# EAGLE schematic GasSensorCentral_v4.0 (EAGLE 7.4.0)
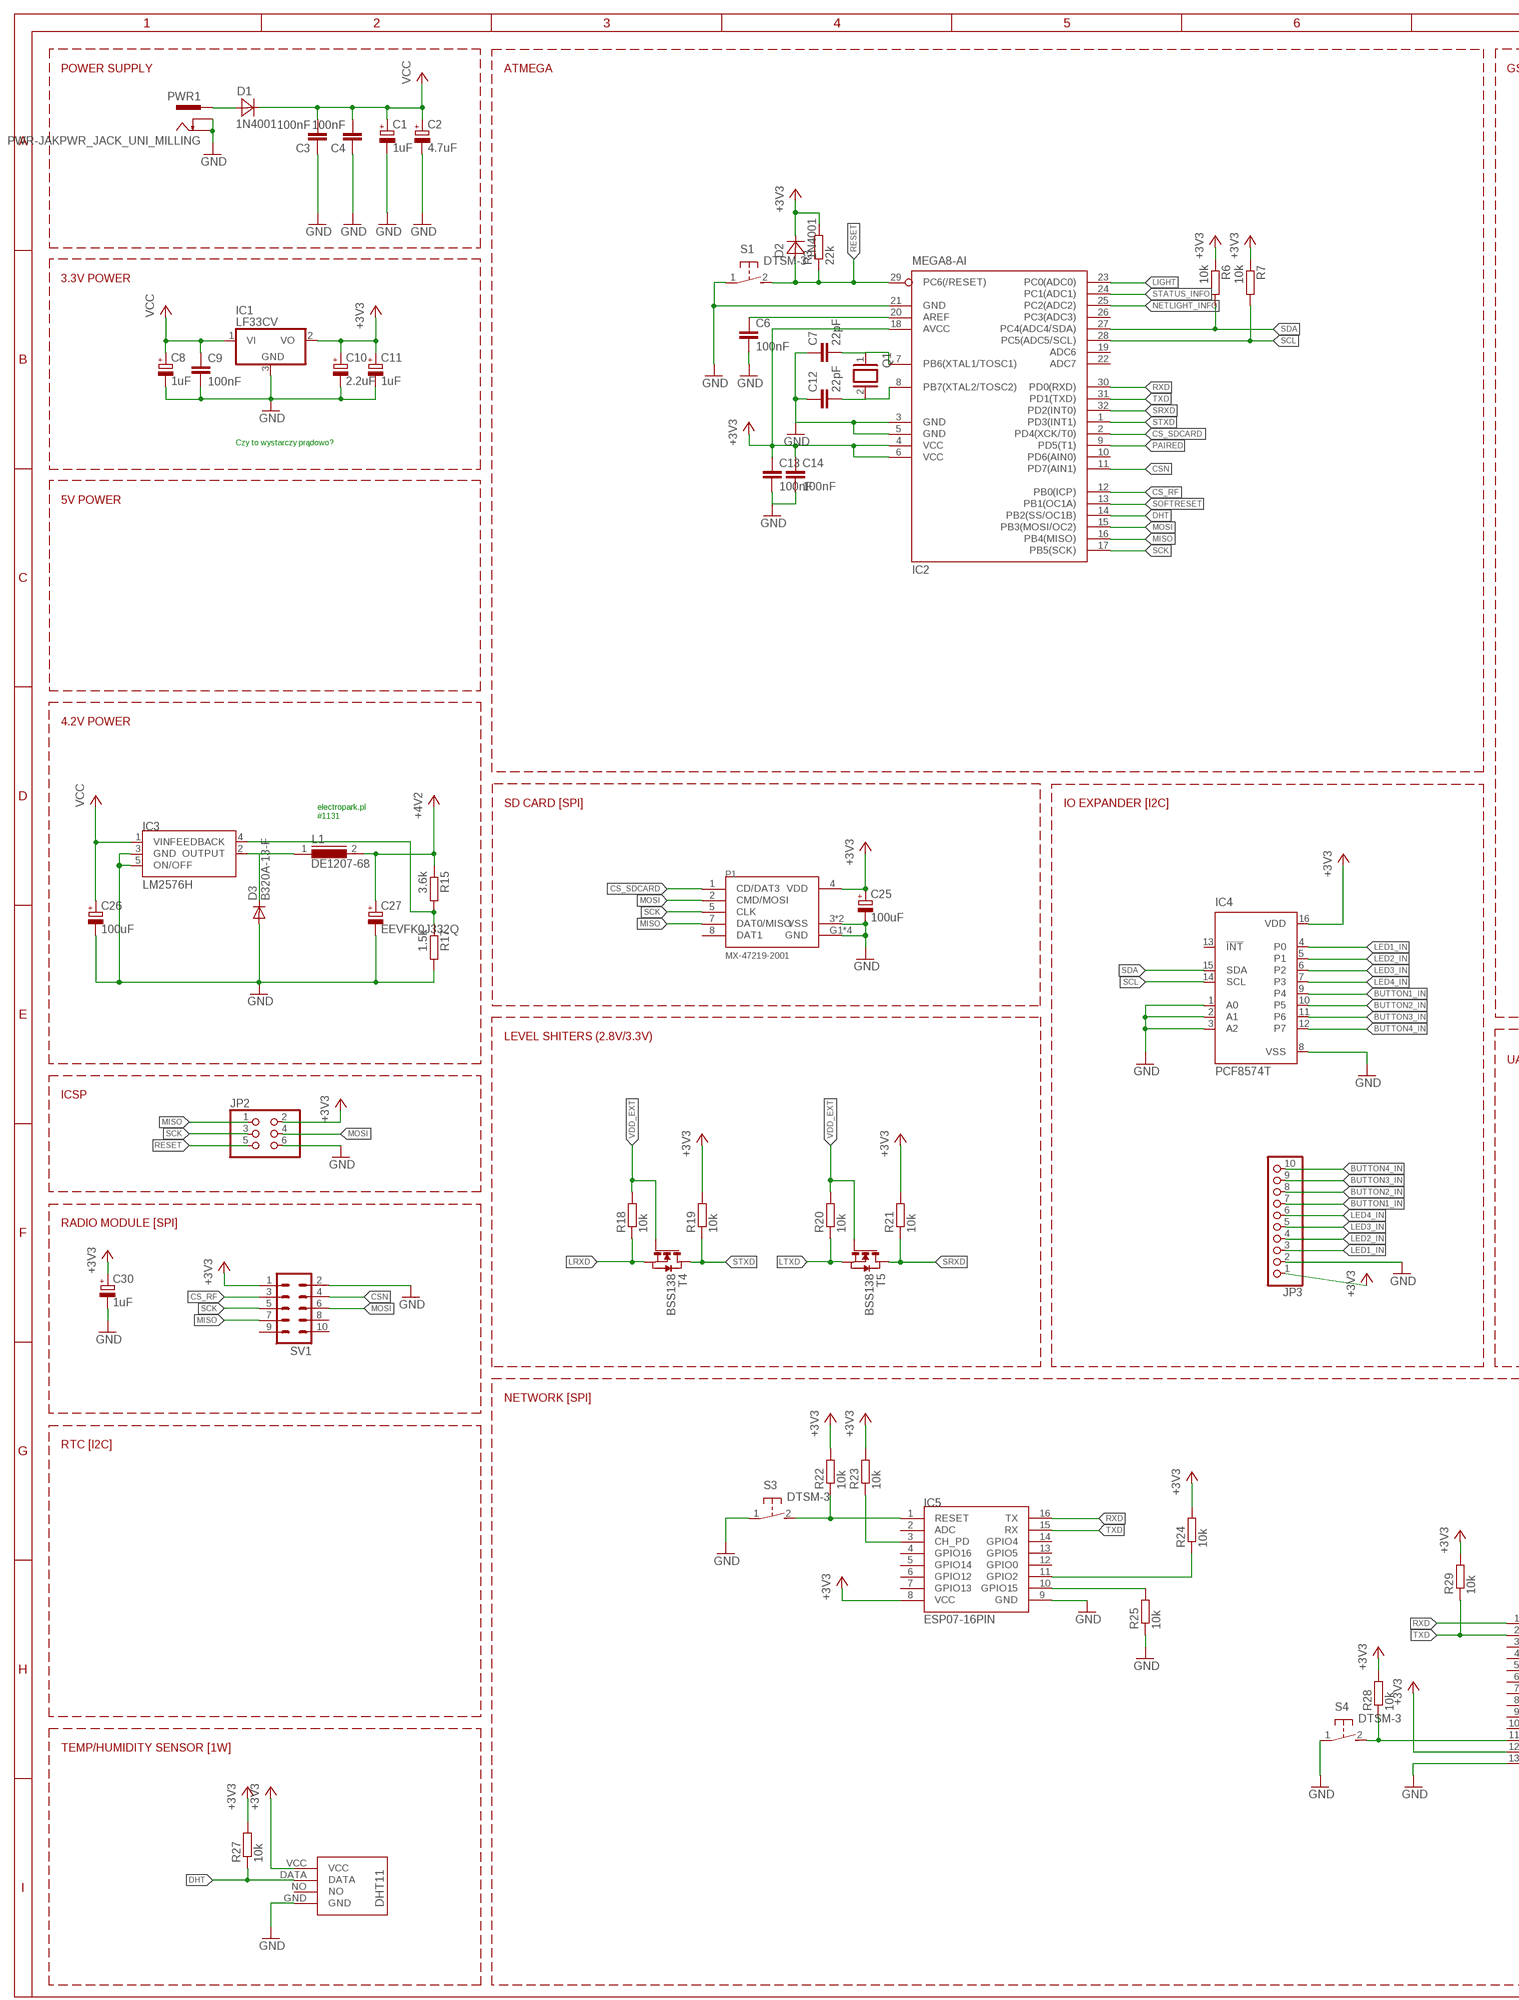
[diagram p0: schematic, sheet 1, part 1 of 2]
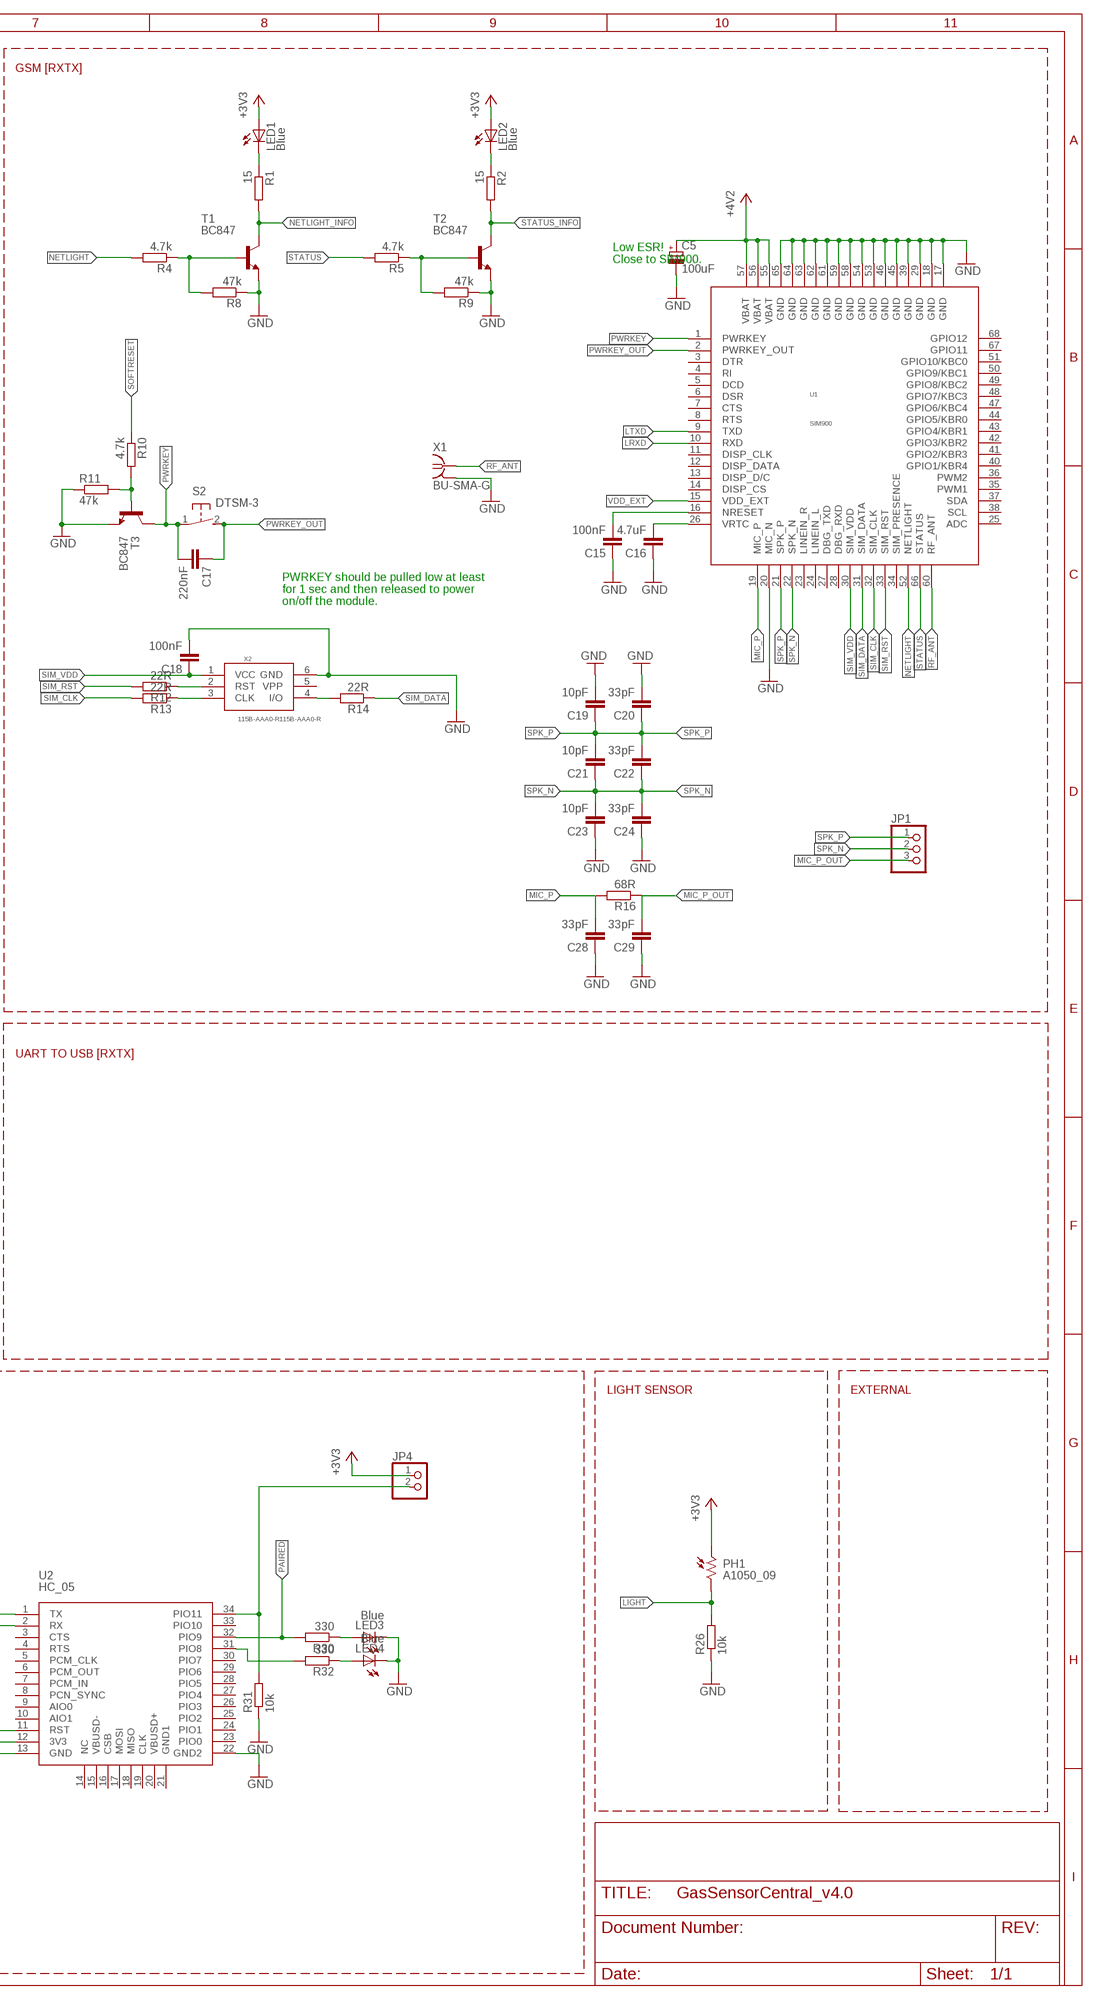
[diagram p1: schematic, sheet 1, part 2 of 2]

## Parts
C1  1uF  CPOL-EUB  [PANASONIC_B]
C2  4.7uF  CPOL-EUB  [PANASONIC_B]
C3  100nF  C-EUC0805  [C0805]
C4  100nF  C-EUC0805  [C0805]
C5  100uF  CPOL-EUB  [PANASONIC_B]
C6  100nF  C-EUC0805  [C0805]
C7  22pF  C-EUC0805  [C0805]
C8  1uF  CPOL-EUB  [PANASONIC_B]
C9  100nF  C-EUC0805  [C0805]
C10  2.2uF  CPOL-EUB  [PANASONIC_B]
C11  1uF  CPOL-EUB  [PANASONIC_B]
C12  22pF  C-EUC0805  [C0805]
C13  100nF  C-EUC0805  [C0805]
C14  100nF  C-EUC0805  [C0805]
C15  100nF  C-EUC0805  [C0805]
C16  4.7uF  C-EUC0805  [C0805]
C17  220nF  C-EUC0805  [C0805]
C18  100nF  C-EUC0805  [C0805]
C19  10pF  C-EUC0805  [C0805]
C20  33pF  C-EUC0805  [C0805]
C21  10pF  C-EUC0805  [C0805]
C22  33pF  C-EUC0805  [C0805]
C23  10pF  C-EUC0805  [C0805]
C24  33pF  C-EUC0805  [C0805]
C25  100uF  CPOL-EUB  [PANASONIC_B]
C26  100uF  CPOL-EUB  [PANASONIC_B]
C27  EEVFK0J332Q  CPOL-EU  [153CLV-1212]
C28  33pF  C-EUC0805  [C0805]
C29  33pF  C-EUC0805  [C0805]
C30  1uF  CPOL-EUB  [PANASONIC_B]
D1  1N4001  MBRA340T3  [SMA]
D2  1N4001  MBRA340T3  [SMA]
D3  B320A-13-F  DIODE-DO214AC  [DO214AC]
IC1  LF33CV  78DT  [TO252]
IC2  MEGA8-AI  [TQFP32-08]
IC3  LM2576H  [TO220-52]
IC4  PCF8574T  [SO16W]
IC5  ESP07-16PIN  [ESP07-16PIN]
IC6  DHT11-PION.  [DHT11-PION.]
JP1  PINHD-1X3/90  [1X03/90]
JP2  PINHD-2X3  [2X03]
JP3  PINHD-1X10  [1X10]
JP4  PINHD-1X2  [1X02]
L1  DE1207-68  DE1207  [DE1207]
LED1  Blue  LEDSML0805  [SML0805]
LED2  Blue  LEDSML0805  [SML0805]
LED3  Blue  LEDSML0805  [SML0805]
LED4  Blue  LEDSML0805  [SML0805]
P1  MX-47219-2001  [MX-47219-2001]
PH1  A1050_09  [T0-46-A10XX]
PWR1  PWR-JAKPWR_JACK_UNI_MILLING  [PWR_JACK_UNI_MILLING]
Q1  XTAL/S  [QS]
R1  15  R-EU_R0805  [R0805]
R2  15  R-EU_R0805  [R0805]
R3  22k  R-EU_R0805  [R0805]
R4  4.7k  R-EU_R0805  [R0805]
R5  4.7k  R-EU_R0805  [R0805]
R6  10k  R-EU_R0805  [R0805]
R7  10k  R-EU_R0805  [R0805]
R8  47k  R-EU_R0805  [R0805]
R9  47k  R-EU_R0805  [R0805]
R10  4.7k  R-EU_R0805  [R0805]
R11  47k  R-EU_R0805  [R0805]
R12  22R  R-EU_R0805  [R0805]
R13  22R  R-EU_R0805  [R0805]
R14  22R  R-EU_R0805  [R0805]
R15  3.6k  R-EU_R0805  [R0805]
R16  68R  R-EU_R0805  [R0805]
R17  1.5k  R-EU_R0805  [R0805]
R18  10k  R-EU_R0805  [R0805]
R19  10k  R-EU_R0805  [R0805]
R20  10k  R-EU_R0805  [R0805]
R21  10k  R-EU_R0805  [R0805]
R22  10k  R-EU_R0805  [R0805]
R23  10k  R-EU_R0805  [R0805]
R24  10k  R-EU_R0805  [R0805]
R25  10k  R-EU_R0805  [R0805]
R26  10k  R-EU_R0805  [R0805]
R27  10k  R-EU_R0805  [R0805]
R28  10k  R-EU_R0805  [R0805]
R29  10k  R-EU_R0805  [R0805]
R30  330  R-EU_R0805  [R0805]
R31  10k  R-EU_R0805  [R0805]
R32  330  R-EU_R0805  [R0805]
S1  DTSM-3  [DTSM-3]
S2  DTSM-3  [DTSM-3]
S3  DTSM-3  [DTSM-3]
S4  DTSM-3  [DTSM-3]
SV1  ML10  [ML10]
T1  BC847  [SOT23]
T2  BC847  [SOT23]
T3  BC847  [SOT23]
T4  BSS138  NMOSSOT23  [SOT-23]
T5  BSS138  NMOSSOT23  [SOT-23]
U1  SIM900  [SIM900]
U2  HC_05  [BLUETOOTH_SMD]
X1  BU-SMA-G  [BU-SMA-G]
X2  115B-AAA0-R115B-AAA0-R  [115B-AAA0-R]

## Nets
+3V3: C10.+ C11.+ C13.1 C14.1 C25.+ C30.+ D2.C IC1.2(VO) IC2.4(VCC) IC2.6(VCC) IC2.18(AVCC) IC4.16(VDD) IC5.8(VCC) IC6.VCC JP2.2 JP3.1 JP4.1 LED1.A LED2.A P1.4(VDD) PH1.1 R3.2 R6.1 R7.1 R19.2 R21.2 R22.2 R23.2 R24.2 R27.2 R28.2 R29.2 SV1.1 U2.12(3V3)
+4V2: C5.+ C27.+ L1.2 R15.1 U1.55(VBAT) U1.56(VBAT) U1.57(VBAT)
BUTTON1_IN: IC4.9(P4) JP3.7
BUTTON2_IN: IC4.10(P5) JP3.8
BUTTON3_IN: IC4.11(P6) JP3.9
BUTTON4_IN: IC4.12(P7) JP3.10
CS_RF: IC2.12(PB0(ICP)) SV1.3
CS_SDCARD: IC2.2(PD4(XCK/T0)) P1.1(CD/DAT3)
CSN: IC2.11(PD7(AIN1)) SV1.4
DHT: IC2.14(PB2(SS/OC1B)) IC6.DATA R27.1
GND: C1.- C2.- C3.1 C4.1 C5.- C6.2 C7.1 C8.- C9.2 C10.- C11.- C12.1 C13.2 C14.2 C15.1 C16.1 C18.2 C19.2 C20.2 C23.1 C24.1 C25.- C26.- C27.- C28.1 C29.1 C30.- IC1.3(GND) IC2.3(GND) IC2.5(GND) IC2.21(GND) IC3.3(GND) IC3.5(ON/OFF) IC4.1(A0) IC4.2(A1) IC4.3(A2) IC4.8(VSS) IC5.9(GND) IC6.GND JP2.6 JP3.2 LED3.C LED4.C P1.3(VSS) P1.6(VSS) P1.G1(GND) P1.G2(GND) P1.G3(GND) P1.G4(GND) PWR1.- PWR1.-1(-) PWR1.-2(-) PWR1.-3(-) PWR1.-4(-) PWR1.-5(-) PWR1.-6(-) PWR1.-7(-) PWR1.-8(-) PWR1.-- PWR1.--1(--) PWR1.--2(--) PWR1.--3(--) PWR1.--4(--) PWR1.--5(--) PWR1.--6(--) PWR1.--7(--) PWR1.--8(--) R8.1 R9.1 R11.1 R17.2 R25.1 R26.1 R31.1 S1.1 S3.1 S4.1 SV1.2 T1.2(E) T2.2(E) T3.2(E) U1.17(GND) U1.18(GND) U1.20(MIC_N) U1.29(GND) U1.39(GND) U1.45(GND) U1.46(GND) U1.53(GND) U1.54(GND) U1.58(GND) U1.59(GND) U1.61(GND) U1.62(GND) U1.63(GND) U1.64(GND) U1.65(GND) U2.13(GND) U2.22(GND2) X1.2 X1.3 X1.4 X1.5 X2.6(GND)
LED1_IN: IC4.4(P0) JP3.3
LED2_IN: IC4.5(P1) JP3.4
LED3_IN: IC4.6(P2) JP3.5
LED4_IN: IC4.7(P3) JP3.6
LIGHT: IC2.23(PC0(ADC0)) PH1.2 R26.2
LRXD: R18.1 T4.2(S) U1.10(RXD)
LTXD: R20.1 T5.2(S) U1.9(TXD)
MIC_P: C28.2 R16.2 U1.19(MIC_P)
MIC_P_OUT: C29.2 JP1.3 R16.1
MISO: IC2.16(PB4(MISO)) JP2.1 P1.7(DAT0/MISO) SV1.7
MOSI: IC2.15(PB3(MOSI/OC2)) JP2.4 P1.2(CMD/MOSI) SV1.6
N$1: C6.1 IC2.20(AREF)
N$2: IC5.1(RESET) R22.1 S3.2
N$3: IC3.4(FEEDBACK) R15.2 R17.1
N$4: D1.A PWR1.+ PWR1.+1(+) PWR1.+2(+) PWR1.+3(+) PWR1.+4(+) PWR1.+5(+) PWR1.+6(+) PWR1.+7(+) PWR1.+8(+)
N$5: R28.1 S4.2 U2.11(RST)
N$6: R14.2 X2.4(I/O)
N$7: LED1.C R1.1
N$8: IC5.3(CH_PD) R23.1
N$9: R5.1 R9.2 T2.1(B)
N$10: D3.A
N$11: LED2.C R2.1
N$12: D3.C IC3.2(OUTPUT) L1.1
N$13: C15.2 U1.16(NRESET)
N$14: R10.2 R11.2 T3.1(B)
N$15: R4.1 R8.2 T1.1(B)
N$16: IC5.11(GPIO2) R24.1
N$17: C16.2 U1.26(VRTC)
N$18: IC5.10(GPIO15) R25.2
N$19: JP4.2 R31.2 U2.34(PIO11)
N$20: LED3.A R30.1
N$21: LED4.A R32.1
N$22: R32.2 U2.31(PIO8)
N$24: R12.1 X2.2(RST)
N$25: R13.1 X2.3(CLK)
N$29: C7.2 IC2.7(PB6(XTAL1/TOSC1)) Q1.1
N$35: C12.2 IC2.8(PB7(XTAL2/TOSC2)) Q1.2
NETLIGHT: R4.2 U1.52(NETLIGHT)
NETLIGHT_INFO: IC2.25(PC2(ADC2)) R1.2 T1.3(C)
PAIRED: IC2.9(PD5(T1)) R30.2 U2.32(PIO9)
PWRKEY: C17.2 S2.1 T3.3(C) U1.1(PWRKEY)
PWRKEY_OUT: C17.1 S2.2 U1.2(PWRKEY_OUT)
RESET: D2.A IC2.29(PC6(/RESET)) JP2.5 R3.1 S1.2
RF_ANT: U1.60(RF_ANT) X1.1
RXD: IC2.30(PD0(RXD)) IC5.16(TX) U2.1(TX)
SCK: IC2.17(PB5(SCK)) JP2.3 P1.5(CLK) SV1.5
SCL: IC2.28(PC5(ADC5/SCL)) IC4.14(SCL) R7.2
SDA: IC2.27(PC4(ADC4/SDA)) IC4.15(SDA) R6.2
SIM_CLK: R13.2 U1.32(SIM_CLK)
SIM_DATA: R14.1 U1.31(SIM_DATA)
SIM_RST: R12.2 U1.33(SIM_RST)
SIM_VDD: C18.1 U1.30(SIM_VDD) X2.1(VCC)
SOFTRESET: IC2.13(PB1(OC1A)) R10.1
SPK_N: C21.1 C22.1 C23.2 C24.2 JP1.2 U1.22(SPK_N)
SPK_P: C19.1 C20.1 C21.2 C22.2 JP1.1 U1.21(SPK_P)
SRXD: IC2.32(PD2(INT0)) R21.1 T5.1(D)
STATUS: R5.2 U1.66(STATUS)
STATUS_INFO: IC2.24(PC1(ADC1)) R2.2 T2.3(C)
STXD: IC2.1(PD3(INT1)) R19.1 T4.1(D)
TXD: IC2.31(PD1(TXD)) IC5.15(RX) R29.1 U2.2(RX)
VCC: C1.+ C2.+ C3.2 C4.2 C8.+ C9.1 C26.+ D1.C IC1.1(VI) IC3.1(VIN)
VDD_EXT: R18.2 R20.2 T4.3(G) T5.3(G) U1.15(VDD_EXT)
Unconnected: IC2.10(PD6(AIN0)) IC2.19(ADC6) IC2.22(ADC7) IC2.26(PC3(ADC3)) IC4.13(!INT) IC5.2(ADC) IC5.4(GPIO16) IC5.5(GPIO14) IC5.6(GPIO12) IC5.7(GPIO13) IC5.12(GPIO0) IC5.13(GPIO5) IC5.14(GPIO4) IC6.NO P1.8(DAT1) SV1.8 SV1.9 SV1.10 U1.3(DTR) U1.4(RI) U1.5(DCD) U1.6(DSR) U1.7(CTS) U1.8(RTS) U1.11(DISP_CLK) U1.12(DISP_DATA) U1.13(DISP_D/C) U1.14(DISP_CS) U1.23(LINEIN_R) U1.24(LINEIN_L) U1.25(ADC) U1.27(DBG_TXD) U1.28(DBG_RXD) U1.34(SIM_PRESENCE) U1.35(PWM1) U1.36(PWM2) U1.37(SDA) U1.38(SCL) U1.40(GPIO1/KBR4) U1.41(GPIO2/KBR3) U1.42(GPIO3/KBR2) U1.43(GPIO4/KBR1) U1.44(GPIO5/KBR0) U1.47(GPIO6/KBC4) U1.48(GPIO7/KBC3) U1.49(GPIO8/KBC2) U1.50(GPIO9/KBC1) U1.51(GPIO10/KBC0) U1.67(GPIO11) U1.68(GPIO12) U2.3(CTS) U2.4(RTS) U2.5(PCM_CLK) U2.6(PCM_OUT) U2.7(PCM_IN) U2.8(PCN_SYNC) U2.9(AIO0) U2.10(AIO1) U2.14(NC) U2.15(VBUSD-) U2.16(CSB) U2.17(MOSI) U2.18(MISO) U2.19(CLK) U2.20(VBUSD+) U2.21(GND1) U2.23(PIO0) U2.24(PIO1) U2.25(PIO2) U2.26(PIO3) U2.27(PIO4) U2.28(PIO5) U2.29(PIO6) U2.30(PIO7) U2.33(PIO10) X2.5(VPP)

## Notes on the sheet
- POWER SUPPLY | ATMEGA | GSM [RXTX]
- Low ESR!
  Close to SIM900.
- 3.3V POWER
- Czy to wystarczy prądowo?
- 5V POWER
- PWRKEY should be pulled low at least 
  for 1 sec and then released to power 
  on/off the module.
- 4.2V POWER
- SD CARD [SPI] | IO EXPANDER [I2C]
- electropark.pl
  #1131
- LEVEL SHITERS (2.8V/3.3V)
- UART TO USB [RXTX]
- ICSP
- RADIO MODULE [SPI]
- NETWORK [SPI] | LIGHT SENSOR | EXTERNAL
- RTC [I2C]
- TEMP/HUMIDITY SENSOR [1W]

## Library data of the parts
C1 C2 C5 C8 C10 C11 C25 C26 C30 = rcl:CPOL-EU: POLARIZED CAPACITOR, European symbol
C3 C4 C6 C7 C9 C12-C24 C28 C29 = rcl:C-EU: CAPACITOR, European symbol
C27 = hosho:CPOL-EU: POLARIZED CAPACITOR, European symbol
D1 D2 = diode:MBRA340T3: Surface Mount Schottky Power Rectifier Source: http://www.onsemi.com/pub_link/Collateral/MBRA340T3-D.PDF
D3 = diode:DIODE-: DIODE
IC1 = hosho:78*: Positive VOLTAGE REGULATOR Source: http://cache.national.com/ds/LM/LM78L05.pdf http://www.fairchildsemi.com/ds/LM/LM7805.pdf
IC2 = atmel:MEGA8: MICROCONTROLLER 8 Kbytes FLASH, 1 kbytes SRAM, 512 bytes EEPROM, USART, 6-channel 10 bit ADC, 2-channel 8 bit ADC Pin compatible with Atmega48, ATMega88, ATMega168 Source: avr.lbr; MPN: ATMEGA8-16AU; OC_FARNELL: 9171371; OC_NEWARK: 73M8863
IC3 = hosho:LM2576H
IC4 = micro-philips:PCF8574: I2C-Bus Remote 8-bit I/O expander http://www.semiconductors.philips.com/acrobat_download/datasheets/PCF8574_4.pdf; MPN: PCF8574T/3,512; OC_FARNELL: 1201255; OC_NEWARK: 70R6870
IC5 = esp8266modules:ESP07-16PIN: ESP8266 Wifi module 07 - 16 pins; DIMENSIONS: 22.0 x 16.0 mm; PINS: 16; PITCH: 0.078" / 2 mm
IC6 = hosho:DHT11-PION.: DHT11 Czujnik temperatury i wilgotności (widok pionowy)
JP1 = pinhead:PINHD-1X3: PIN HEADER
JP2 = pinhead:PINHD-2X3: PIN HEADER
JP3 = pinhead:PINHD-1X10: PIN HEADER
JP4 = pinhead:PINHD-1X2: PIN HEADER
L1 = hosho:DE1207: High Power Density, High Efficiency, Shielded Inductors Source: coiltronics_dr_series.pdf
LED1-LED4 = led:LED: LED OSRAM: - CHIPLED LG R971, LG N971, LY N971, LG Q971, LY Q971, LO R971, LY R971 LH N974, LH R974 LS Q976, LO Q976, LY Q976 LO Q996 - Hyper CHIPLED LW Q18S LB Q993, LB Q99A, LB R99A - SideLED LS A670, LO A670, LY A670, LG A670, LP A670 LB A673, LV A673, LT A673, LW A673 LH A674 LY A675 LS A676, LA A676, LO A676, LY A676, LW A676 LS A679, LY A679, LG A679 - Hyper Micro SIDELED® LS Y876, LA Y876, LO Y876, LY Y876 LT Y87S - SmartLED LW L88C, LW L88S LB L89C, LB L89S, LG L890 LS L89K, LO L89K, LY L89K LS L896, LA L896, LO L896, LY L896 - TOPLED LS T670, LO T670, LY T670, LG T670, LP T670 LSG T670, LSP T670, LSY T670, LOP T670, LYG T670 LG T671, LOG T671, LSG T671 LB T673, LV T673, LT T673, LW T673 LH T674 LS T676, LA T676, LO T676, LY T676, LB T676, LH T676, LSB T676, LW T676 LB T67C, LV T67C, LT T67C, LS T67K, LO T67K, LY T67K, LW E67C LS E67B, LA E67B, LO E67B, LY E67B, LB E67C, LV E67C, LT E67C LW T67C LS T679, LY T679, LG T679 LS T770, LO T770, LY T770, LG T770, LP T770 LB T773, LV T773, LT T773, LW T773 LH T774 LS E675, LA E675, LY E675, LS T675 LS T776, LA T776, LO T776, LY T776, LB T776 LHGB T686 LT T68C, LB T68C - Hyper Mini TOPLED® LB M676 - Mini TOPLED Santana® LG M470 LS M47K, LO M47K, LY M47K Source: http://www.osram.convergy.de LUXEON: - LUMILED® LXK2-PW12-R00, LXK2-PW12-S00, LXK2-PW14-U00, LXK2-PW14-V00 LXK2-PM12-R00, LXK2-PM12-S00, LXK2-PM14-U00 LXK2-PE12-Q00, LXK2-PE12-R00, LXK2-PE12-S00, LXK2-PE14-T00, LXK2-PE14-U00 LXK2-PB12-K00, LXK2-PB12-L00, LXK2-PB12-M00, LXK2-PB14-N00, LXK2-PB14-P00, LXK2-PB14-Q00 LXK2-PR12-L00, LXK2-PR12-M00, LXK2-PR14-Q00, LXK2-PR14-R00 LXK2-PD12-Q00, LXK2-PD12-R00, LXK2-PD12-S00 LXK2-PH12-R00, LXK2-PH12-S00 LXK2-PL12-P00, LXK2-PL12-Q00, LXK2-PL12-R00 Source: www.luxeon.com KINGBRIGHT: KA-3528ASYC Source: www.kingbright.com
P1 = hosho:MX-47219-2001
PH1 = photo-elements:A10: Sensor Robust Light Sensing Applications Outdoor Light Sensing Application Source: http://optoelectronics.perkinelmer.com/content/Datasheets/DTS_PhotocellsA1050.pdf
PWR1 = hosho:PWR-JAK
Q1 = hosho:XTAL/S: CRYSTAL
R1-R32 = rcl:R-EU_: RESISTOR, European symbol
S1-S4 = hosho:DTSM-3
SV1 = con-harting-ml:ML10: HARTING; OC_FARNELL: unknown; OC_NEWARK: unknown
T1-T3 = transistor:BC847: NPN TRANSISTOR
T4 T5 = zetex:NMOSSOT23: MOS FET; OC_FARNELL: unknown; OC_NEWARK: unknown
U1 = hosho:SIM900
U2 = hosho:HC_05: HC-05 Bluetooth Module
X1 = hosho:BU-SMA-G: FEMALE SMA CONNECTOR Radiall distributor RS 193-9117; OC_FARNELL: unknown; OC_NEWARK: unknown
X2 = hosho:115B-AAA0-R